# EAGLE schematic Matric PCB (EAGLE 8.2.0)
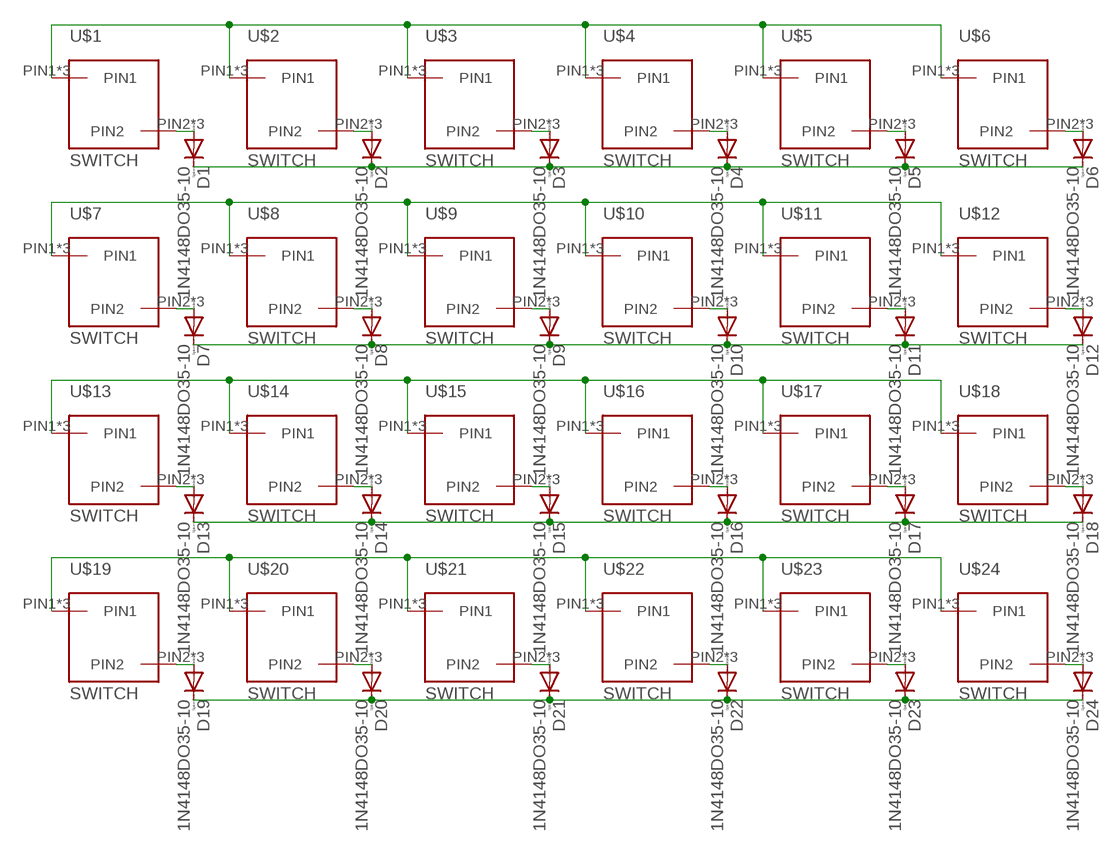
[diagram p0: schematic, sheet 1]

## Parts
D1  1N4148DO35-10  [DO35-10]
D2  1N4148DO35-10  [DO35-10]
D3  1N4148DO35-10  [DO35-10]
D4  1N4148DO35-10  [DO35-10]
D5  1N4148DO35-10  [DO35-10]
D6  1N4148DO35-10  [DO35-10]
D7  1N4148DO35-10  [DO35-10]
D8  1N4148DO35-10  [DO35-10]
D9  1N4148DO35-10  [DO35-10]
D10  1N4148DO35-10  [DO35-10]
D11  1N4148DO35-10  [DO35-10]
D12  1N4148DO35-10  [DO35-10]
D13  1N4148DO35-10  [DO35-10]
D14  1N4148DO35-10  [DO35-10]
D15  1N4148DO35-10  [DO35-10]
D16  1N4148DO35-10  [DO35-10]
D17  1N4148DO35-10  [DO35-10]
D18  1N4148DO35-10  [DO35-10]
D19  1N4148DO35-10  [DO35-10]
D20  1N4148DO35-10  [DO35-10]
D21  1N4148DO35-10  [DO35-10]
D22  1N4148DO35-10  [DO35-10]
D23  1N4148DO35-10  [DO35-10]
D24  1N4148DO35-10  [DO35-10]
U$1  SWITCH  [SWITCH]
U$2  SWITCH  [SWITCH]
U$3  SWITCH  [SWITCH]
U$4  SWITCH  [SWITCH]
U$5  SWITCH  [SWITCH]
U$6  SWITCH  [SWITCH]
U$7  SWITCH  [SWITCH]
U$8  SWITCH  [SWITCH]
U$9  SWITCH  [SWITCH]
U$10  SWITCH  [SWITCH]
U$11  SWITCH  [SWITCH]
U$12  SWITCH  [SWITCH]
U$13  SWITCH  [SWITCH]
U$14  SWITCH  [SWITCH]
U$15  SWITCH  [SWITCH]
U$16  SWITCH  [SWITCH]
U$17  SWITCH  [SWITCH]
U$18  SWITCH  [SWITCH]
U$19  SWITCH  [SWITCH]
U$20  SWITCH  [SWITCH]
U$21  SWITCH  [SWITCH]
U$22  SWITCH  [SWITCH]
U$23  SWITCH  [SWITCH]
U$24  SWITCH  [SWITCH]

## Nets
N$1: D1.A U$1.PIN2 U$1.PIN2EXT(PIN2) U$1.PIN2MAT(PIN2)
N$2: D2.A U$2.PIN2 U$2.PIN2EXT(PIN2) U$2.PIN2MAT(PIN2)
N$3: D3.A U$3.PIN2 U$3.PIN2EXT(PIN2) U$3.PIN2MAT(PIN2)
N$4: D4.A U$4.PIN2 U$4.PIN2EXT(PIN2) U$4.PIN2MAT(PIN2)
N$5: D5.A U$5.PIN2 U$5.PIN2EXT(PIN2) U$5.PIN2MAT(PIN2)
N$6: D6.A U$6.PIN2 U$6.PIN2EXT(PIN2) U$6.PIN2MAT(PIN2)
N$7: D7.A U$7.PIN2 U$7.PIN2EXT(PIN2) U$7.PIN2MAT(PIN2)
N$8: D8.A U$8.PIN2 U$8.PIN2EXT(PIN2) U$8.PIN2MAT(PIN2)
N$9: D9.A U$9.PIN2 U$9.PIN2EXT(PIN2) U$9.PIN2MAT(PIN2)
N$10: D10.A U$10.PIN2 U$10.PIN2EXT(PIN2) U$10.PIN2MAT(PIN2)
N$11: D11.A U$11.PIN2 U$11.PIN2EXT(PIN2) U$11.PIN2MAT(PIN2)
N$12: D12.A U$12.PIN2 U$12.PIN2EXT(PIN2) U$12.PIN2MAT(PIN2)
N$13: D13.A U$13.PIN2 U$13.PIN2EXT(PIN2) U$13.PIN2MAT(PIN2)
N$14: D14.A U$14.PIN2 U$14.PIN2EXT(PIN2) U$14.PIN2MAT(PIN2)
N$15: D15.A U$15.PIN2 U$15.PIN2EXT(PIN2) U$15.PIN2MAT(PIN2)
N$16: D16.A U$16.PIN2 U$16.PIN2EXT(PIN2) U$16.PIN2MAT(PIN2)
N$17: D17.A U$17.PIN2 U$17.PIN2EXT(PIN2) U$17.PIN2MAT(PIN2)
N$18: D18.A U$18.PIN2 U$18.PIN2EXT(PIN2) U$18.PIN2MAT(PIN2)
N$19: D19.A U$19.PIN2 U$19.PIN2EXT(PIN2) U$19.PIN2MAT(PIN2)
N$20: D20.A U$20.PIN2 U$20.PIN2EXT(PIN2) U$20.PIN2MAT(PIN2)
N$21: D21.A U$21.PIN2 U$21.PIN2EXT(PIN2) U$21.PIN2MAT(PIN2)
N$22: D22.A U$22.PIN2 U$22.PIN2EXT(PIN2) U$22.PIN2MAT(PIN2)
N$23: D23.A U$23.PIN2 U$23.PIN2EXT(PIN2) U$23.PIN2MAT(PIN2)
N$24: D24.A U$24.PIN2 U$24.PIN2EXT(PIN2) U$24.PIN2MAT(PIN2)
N$25: U$1.PIN1 U$1.PIN1EXTX(PIN1) U$1.PIN1MAT(PIN1) U$2.PIN1 U$2.PIN1EXTX(PIN1) U$2.PIN1MAT(PIN1) U$3.PIN1 U$3.PIN1EXTX(PIN1) U$3.PIN1MAT(PIN1) U$4.PIN1 U$4.PIN1EXTX(PIN1) U$4.PIN1MAT(PIN1) U$5.PIN1 U$5.PIN1EXTX(PIN1) U$5.PIN1MAT(PIN1) U$6.PIN1 U$6.PIN1EXTX(PIN1) U$6.PIN1MAT(PIN1)
N$26: D1.C D2.C D3.C D4.C D5.C D6.C
N$27: D7.C D8.C D9.C D10.C D11.C D12.C
N$28: D13.C D14.C D15.C D16.C D17.C D18.C
N$29: D19.C D20.C D21.C D22.C D23.C D24.C
N$30: U$7.PIN1 U$7.PIN1EXTX(PIN1) U$7.PIN1MAT(PIN1) U$8.PIN1 U$8.PIN1EXTX(PIN1) U$8.PIN1MAT(PIN1) U$9.PIN1 U$9.PIN1EXTX(PIN1) U$9.PIN1MAT(PIN1) U$10.PIN1 U$10.PIN1EXTX(PIN1) U$10.PIN1MAT(PIN1) U$11.PIN1 U$11.PIN1EXTX(PIN1) U$11.PIN1MAT(PIN1) U$12.PIN1 U$12.PIN1EXTX(PIN1) U$12.PIN1MAT(PIN1)
N$31: U$13.PIN1 U$13.PIN1EXTX(PIN1) U$13.PIN1MAT(PIN1) U$14.PIN1 U$14.PIN1EXTX(PIN1) U$14.PIN1MAT(PIN1) U$15.PIN1 U$15.PIN1EXTX(PIN1) U$15.PIN1MAT(PIN1) U$16.PIN1 U$16.PIN1EXTX(PIN1) U$16.PIN1MAT(PIN1) U$17.PIN1 U$17.PIN1EXTX(PIN1) U$17.PIN1MAT(PIN1) U$18.PIN1 U$18.PIN1EXTX(PIN1) U$18.PIN1MAT(PIN1)
N$32: U$19.PIN1 U$19.PIN1EXTX(PIN1) U$19.PIN1MAT(PIN1) U$20.PIN1 U$20.PIN1EXTX(PIN1) U$20.PIN1MAT(PIN1) U$21.PIN1 U$21.PIN1EXTX(PIN1) U$21.PIN1MAT(PIN1) U$22.PIN1 U$22.PIN1EXTX(PIN1) U$22.PIN1MAT(PIN1) U$23.PIN1 U$23.PIN1EXTX(PIN1) U$23.PIN1MAT(PIN1) U$24.PIN1 U$24.PIN1EXTX(PIN1) U$24.PIN1MAT(PIN1)

## Library data of the parts
D1-D24 = diode:1N4148: DIODE high speed (Philips)
U$1-U$24 = ComboSwitch:SWITCH